# Altium schematic sheet mcu.SchDoc
size A4; SheetNumber: 1; SheetTotal: 3
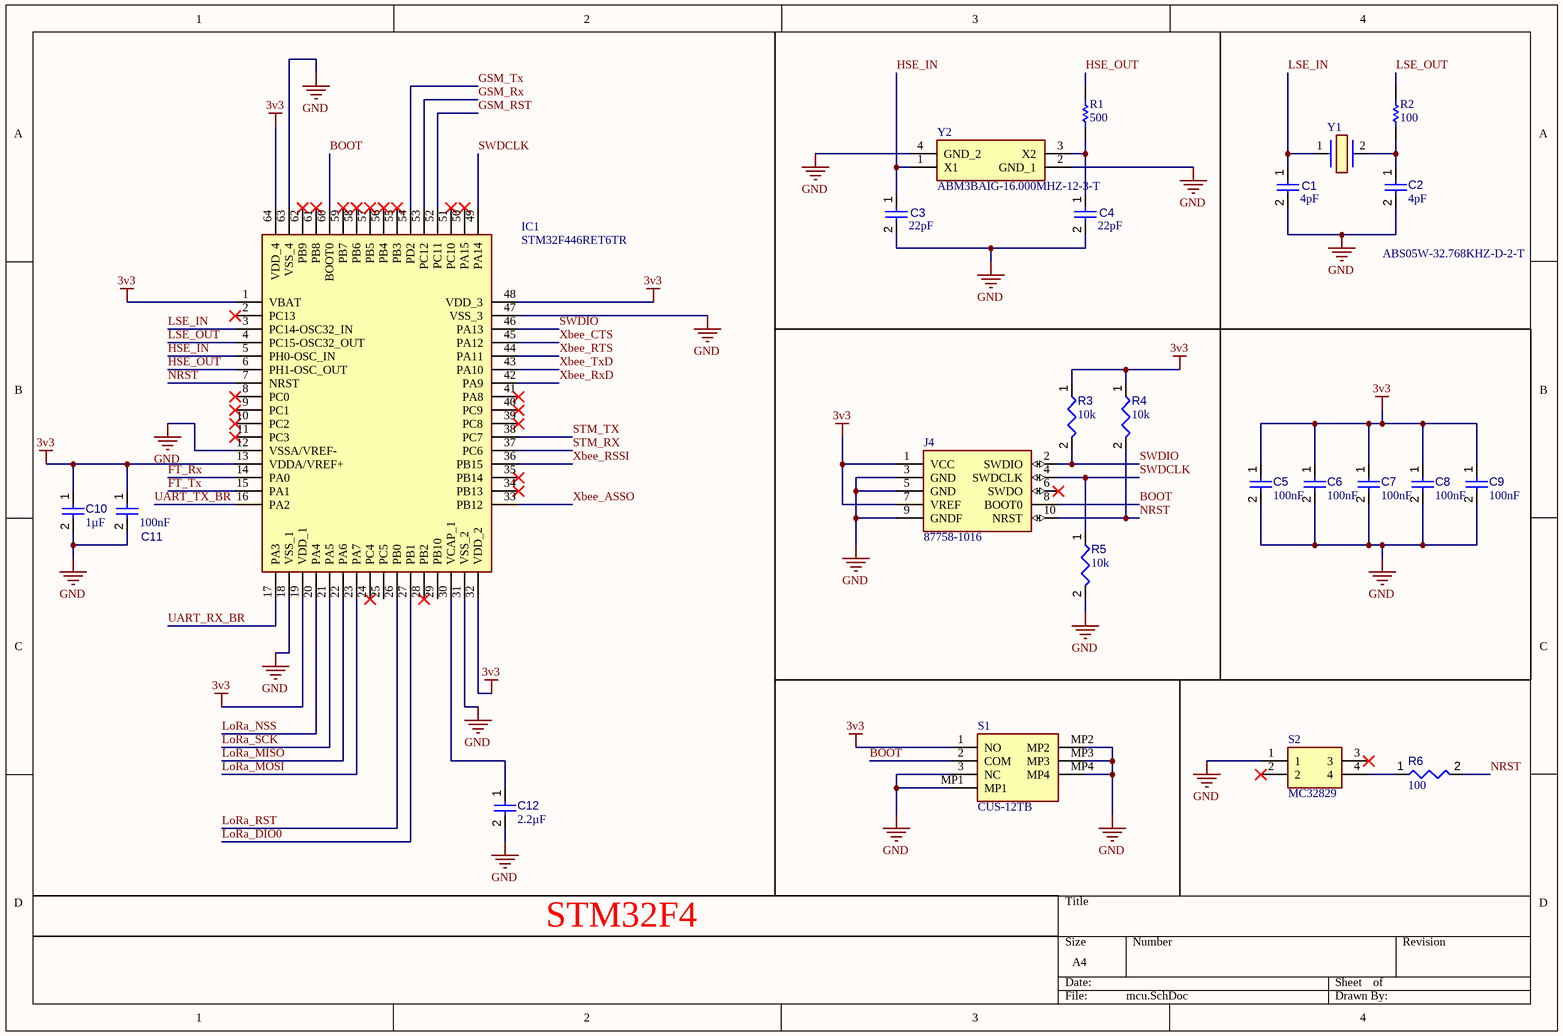
[diagram p0: mcu.SchDoc]

## Parts
C1  value 4pF  [CAPC1608X90X40LL10T20]  (hidden comment: Capacitor 1 uF +/- 10% 25 V 0603)
C2  value 4pF  [CAPC1608X90X40LL10T20]  (hidden comment: Capacitor 1 uF +/- 10% 25 V 0603)
C3  value 22pF  [CAPC1608X90X40LL10T20]  (hidden comment: Capacitor 1 uF +/- 10% 25 V 0603)
C4  value 22pF  [CAPC1608X90X40LL10T20]  (hidden comment: Capacitor 1 uF +/- 10% 25 V 0603)
C5  value 100nF  [CAPC1608X90X40NL10T20]  (hidden comment: Capacitor 100 nF +/-10% 50 V 0603)
C6  value 100nF  [CAPC1608X90X40NL10T20]  (hidden comment: Capacitor 100 nF +/-10% 50 V 0603)
C7  value 100nF  [CAPC1608X90X40NL10T20]  (hidden comment: Capacitor 100 nF +/-10% 50 V 0603)
C8  value 100nF  [CAPC1608X90X40NL10T20]  (hidden comment: Capacitor 100 nF +/-10% 50 V 0603)
C9  value 100nF  [CAPC1608X90X40NL10T20]  (hidden comment: Capacitor 100 nF +/-10% 50 V 0603)
C10  value 1µF  [CAPC2013X135X45NL10T25]  (hidden comment: Capacitor 1 uF +/- 10% 50 V 0805)
C11  value 100nF  [CAPC1608X90X40NL10T20]  (hidden comment: Capacitor 100 nF +/-10% 50 V 0603)
C12  value 2.2µF  [CAPC2013X135X45NL10T25]  (hidden comment: Capacitor 1 uF +/- 10% 50 V 0805)
IC1  STM32F446RET6TR  [QFP50P1200X1200X160-64N]
J4  87758-1016  [HDRV10W75P200_2X5_990X400X595P]
R1  value 500  [RESC1005X40X25ML05T05]  (hidden comment: Resistor 0R +/- 5% 0402 100 mW)
R2  value 100  [RESC1005X40X25ML05T05]  (hidden comment: Resistor 0R +/- 5% 0402 100 mW)
R3  value 10k  [RESC1608X55X25ML10T15]  (hidden comment: Resistor 10k +/-1% 0603 100 mW)
R4  value 10k  [RESC1608X55X25ML10T15]  (hidden comment: Resistor 10k +/-1% 0603 100 mW)
R5  value 10k  [RESC1608X55X25ML10T15]  (hidden comment: Resistor 10k +/-1% 0603 100 mW)
R6  value 100  [RESC1608X55X25ML10T15]  (hidden comment: Resistor 10k +/-1% 0603 100 mW)
S1  CUS-12TB  [CUS12TB]
S2  MC32829  [MC32829]
Y1  ABS05W-32.768KHZ-D-2-T  [ABS05W32768KHZD2T]
Y2  ABM3BAIG-16.000MHZ-12-3-T  [ABM3BAIG]

## Nets
3v3: C5.1 C6.1 C7.1 C8.1 C9.1 C10.1 C11.1 IC1.1(VBAT) IC1.13(VDDA/VREF+) IC1.19(VDD_1) IC1.32(VDD_2) IC1.48(VDD_3) IC1.64(VDD_4) J4.1(VCC) J4.7(VREF) R3.1 R4.1 S1.1(NO)
GND: C1.2 C2.2 C3.2 C4.2 C5.2 C6.2 C7.2 C8.2 C9.2 C10.2 C11.2 C12.2 IC1.12(VSSA/VREF-) IC1.18(VSS_1) IC1.31(VSS_2) IC1.47(VSS_3) IC1.63(VSS_4) J4.3(GND) J4.5(GND) J4.9(GNDF) R5.2 S1.3(NC) S1.MP1 S1.MP2 S1.MP3 S1.MP4 S2.1 Y2.2(GND_1) Y2.4(GND_2)
BOOT: IC1.60(BOOT0) J4.8(BOOT0) S1.2(COM)
FT_Rx: IC1.14(PA0)
FT_Tx: IC1.15(PA1)
GSM_RST: IC1.52(PC11)
GSM_Rx: IC1.53(PC12)
GSM_Tx: IC1.54(PD2)
HSE_IN: C3.1 IC1.5(PH0-OSC_IN) Y2.1(X1)
HSE_OUT: IC1.6(PH1-OSC_OUT) R1.2
LoRa_DIO0: IC1.27(PB1)
LoRa_MISO: IC1.22(PA6)
LoRa_MOSI: IC1.23(PA7)
LoRa_NSS: IC1.20(PA4)
LoRa_RST: IC1.26(PB0)
LoRa_SCK: IC1.21(PA5)
LSE_IN: C1.1 IC1.3(PC14-OSC32_IN) Y1.1
LSE_OUT: IC1.4(PC15-OSC32_OUT) R2.2
NRST: IC1.7(NRST) J4.10(NRST) R4.2 R6.2
STM_RX: IC1.37(PC6)
STM_TX: IC1.38(PC7)
SWDCLK: IC1.49(PA14) J4.4(SWDCLK) R5.1
SWDIO: IC1.46(PA13) J4.2(SWDIO) R3.2
UART_RX_BR: IC1.17(PA3)
UART_TX_BR: IC1.16(PA2)
Xbee_ASSO: IC1.33(PB12)
Xbee_CTS: IC1.45(PA12)
Xbee_RSSI: IC1.36(PB15)
Xbee_RTS: IC1.44(PA11)
Xbee_RxD: IC1.42(PA9)
Xbee_TxD: IC1.43(PA10)
NetC2_1: C2.1 R2.1 Y1.2
NetC4_1: C4.1 R1.1 Y2.3(X2)
NetC12_1: C12.1 IC1.30(VCAP_1)
NetR6_1: R6.1 S2.4

Not connected (* = marked no-connect by the designer): IC1 2(PC13)* 8(PC0)* 9(PC1)* 10(PC2)* 11(PC3)* 24(PC4)* 25(PC5) 28(PB2)* 29(PB10) 34(PB13)* 35(PB14)* 39(PC8)* 40(PC9)* 41(PA8)* 50(PA15)* 51(PC10)* 55(PB3)* 56(PB4)* 57(PB5)* 58(PB6)* 59(PB7)* 61(PB8)* 62(PB9)*; J4 6(SWDO)*; S2 2* 3*

## Notes on the sheet
- STM32F4

## Library data of the parts
C1-C4 = CMP-001-00005-6: Chip Capacitor, 1 uF, +/- 10%, 25 V, 0603 (1608 Metric); Capacitor Type: Ceramic; Voltage Rating: 25V; Pins: 2; Mounting Technology: SM; RoHS Compliant: True; Max Operating Temperature: 125°C; Case/Package: 0603; Min Operating Temperature: -55°C; Tolerance: 10%
C5-C9 C11 = CMP-001-00017-6: Chip Capacitor, 100 nF, +/- 10%, 50 V, 0603 (1608 Metric); Voltage Rating: 50V; Capacitor Type: Ceramic; Tolerance: 10%; Mounting Technology: SM; Max Operating Temperature: 125°C; RoHS Compliant: True; Pins: 2; Case/Package: 0603; Min Operating Temperature: -55°C
C10 C12 = CMP-001-00007-6: Chip Capacitor, 1 uF, +/- 10%, 50 V, 0805 (2012 Metric); Capacitor Type: Ceramic; Voltage Rating: 50V; Min Operating Temperature: -55°C; RoHS Compliant: True; Mounting Technology: SM; Case/Package: 0805; Max Operating Temperature: 125°C; Tolerance: 10%; Pins: 2
IC1 = STM32F446RET6TR: Integrated Circuit; Manufacturer_Name: STMicroelectronics; Datasheet Link: https://www.arrow.com/en/products/stm32f446ret6tr/stmicroelectronics; Height: 1.6mm; Manufacturer_Part_Number: STM32F446RET6TR; Mouser Part Number: 511-STM32F446RET6TR; Mouser Price/Stock: https://www.mouser.co.uk/ProductDetail/STMicroelectronics/STM32F446RET6TR?qs=xZ%2FP%252Ba9zWqYaBJrnMqQZtg%3D%3D; Arrow Part Number: STM32F446RET6TR; Arrow Price/Stock: https://www.arrow.com/en/products/stm32f446ret6tr/stmicroelectronics?utm_currency=USD&region=nac
J4 = 87758-1016: Connector; Manufacturer_Name: Molex; Datasheet Link: http://www.molex.com/pdm_docs/sd/877581016_sd.pdf; Height: 5.95mm; Manufacturer_Part_Number: 87758-1016; Mouser Part Number: 538-87758-1016; Mouser Price/Stock: https://www.mouser.co.uk/ProductDetail/Molex/87758-1016?qs=9Wl4wMk6NjrOw5AcqxMewg%3D%3D; Arrow Part Number: 87758-1016; Arrow Price/Stock: https://www.arrow.com/en/products/87758-1016/molex?region=nac
R1 R2 = CMP-009-00005-5: Chip Resistor, 0 Ohm, 0.1 W, -55 to 155 degC, 0402 (1005 Metric); Power: 100mW; Voltage Rating: 50V; Pins: 2; Tolerance: 5%; Case/Package: 0402; Mounting Technology: SM; Max Operating Temperature: 155°C; Min Operating Temperature: -55°C; RoHS Compliant: True
R3-R6 = CMP-009-00017-5: Chip Resistor, 10 KOhm, +/- 1%, 01 W, -55 to 155 degC, 0603 (1608 Metric); Voltage Rating: 50V; Power: 100mW; RoHS Compliant: True; Min Operating Temperature: -55°C; Pins: 2; Case/Package: 0603; Mounting Technology: SM; Max Operating Temperature: 155°C; Tolerance: 1%
S1 = CUS-12TB: Switch; Manufacturer_Name: Nidec Copal; Datasheet Link: https://www.nidec-copal-electronics.com/e/catalog/switch/cus.pdf; Height: 1.4mm; Manufacturer_Part_Number: CUS-12TB; Mouser Part Number: 229-CUS-12TB; Mouser Price/Stock: https://www.mouser.co.uk/ProductDetail/Nidec-Components/CUS-12TB?qs=XeJtXLiO41Q1Ug1dC3Bq%2FQ%3D%3D
S2 = MC32829: Switch; Manufacturer_Name: Multicomp Pro; Datasheet Link: http://www.farnell.com/datasheets/2945655.pdf; Height: 6mm; Manufacturer_Part_Number: MC32829
Y1 = ABS05W-32.768KHZ-D-2-T: Crystal or Oscillator; Manufacturer_Name: ABRACON; Datasheet Link: https://abracon.com/Resonators/ABS05W.pdf; Height: 0.5mm; Manufacturer_Part_Number: ABS05W-32.768KHZ-D-2-T; Mouser Part Number: 815-ABS05W32.768KD2T; Mouser Price/Stock: https://www.mouser.co.uk/ProductDetail/ABRACON/ABS05W-32.768KHZ-D-2-T?qs=r5DSvlrkXmJ0aADBg3hvfA%3D%3D; Arrow Part Number: ABS05W-32.768KHZ-D-2-T; Arrow Price/Stock: https://www.arrow.com/en/products/abs05w-32.768khz-d-2-t/abracon?utm_currency=USD&region=nac
Y2 = ABM3BAIG-16.000MHZ-12-3-T: Crystal or Oscillator; Manufacturer_Name: ABRACON; Datasheet Link: https://abracon.com/AIGcrystals/ABM3BAIG.pdf; Height: 0.9mm; Manufacturer_Part_Number: ABM3BAIG-16.000MHZ-12-3-T